# Altium schematic sheet Block_Diagram.SchDoc: Block_Diagram
size 420 x 297 mm; DrawnBy: Linh Vu; SheetNumber: 1; SheetTotal: 6; MasterProject: BTL_TKHTN
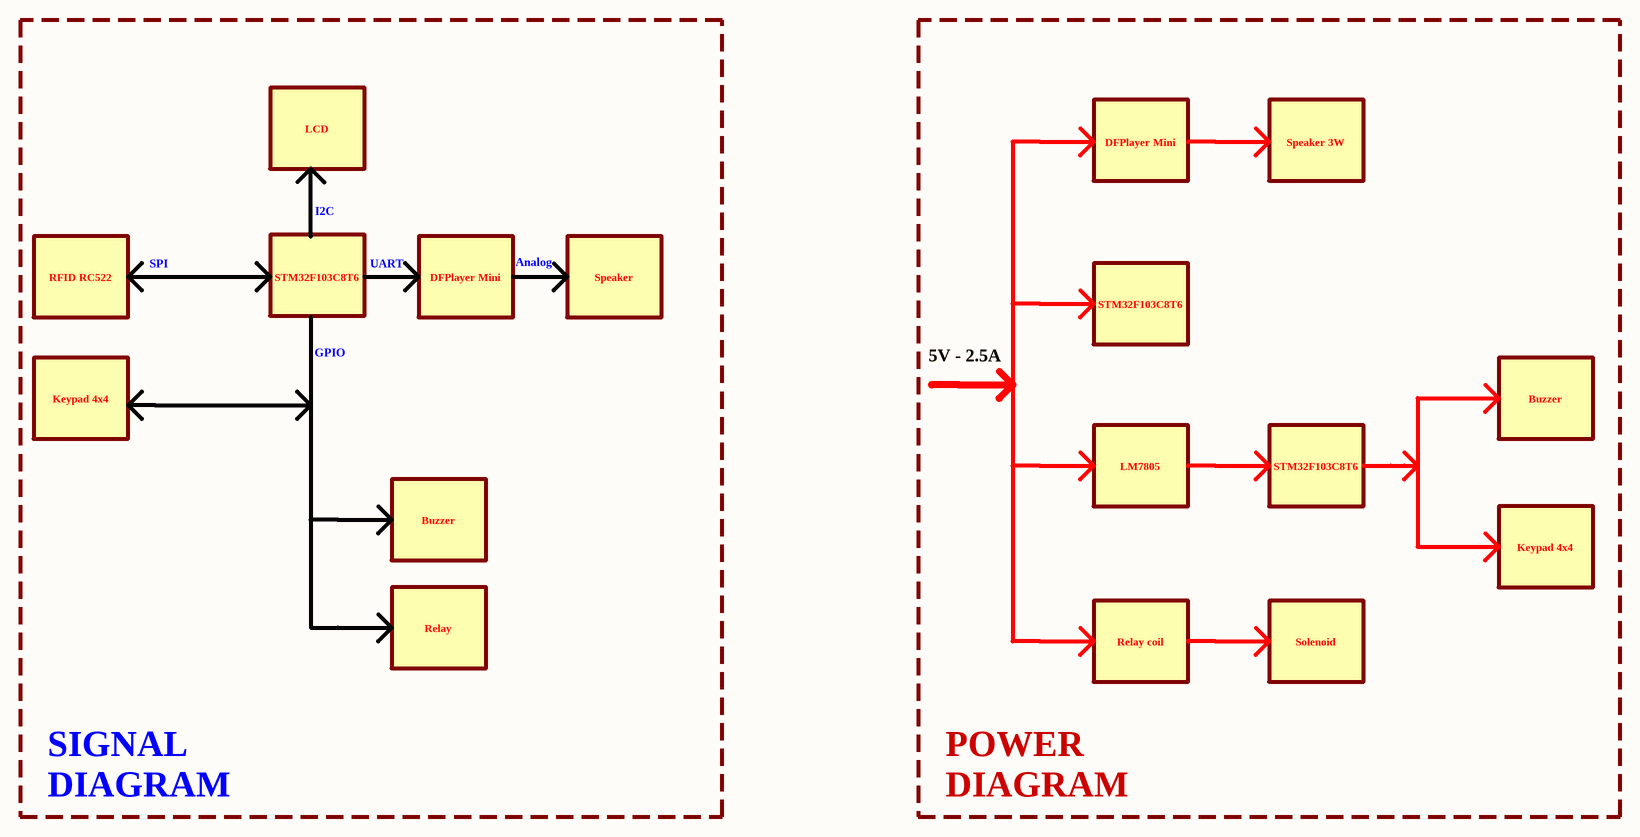
[diagram p0: Block_Diagram.SchDoc]

## Notes on the sheet
- LCD
- 620mA
- 5V
- DFPlayer Mini
- 600mA
- Speaker 3W
- I2C
- RFID RC522
- SPI
- STM32F103C8T6
- UART
- Analog
- Speaker
- GPIO
- 30mA
- Keypad 4x4
- 5V - 2.5A
- 3V3
- 2mA
- Buzzer
- 45mA
- LM7805
- 6mA
- Relay
- 1300mA
- Relay coil
- 1000mA
- Solenoid
- SIGNAL
  DIAGRAM
- POWER
  DIAGRAM
- Sub-system:
- Project:
- Design by:
- Sheet title:
- Sheet
- of
- Checked by:
- Approved by:
- Doc No:
- Revision:
- Size:
- Date:
- A3